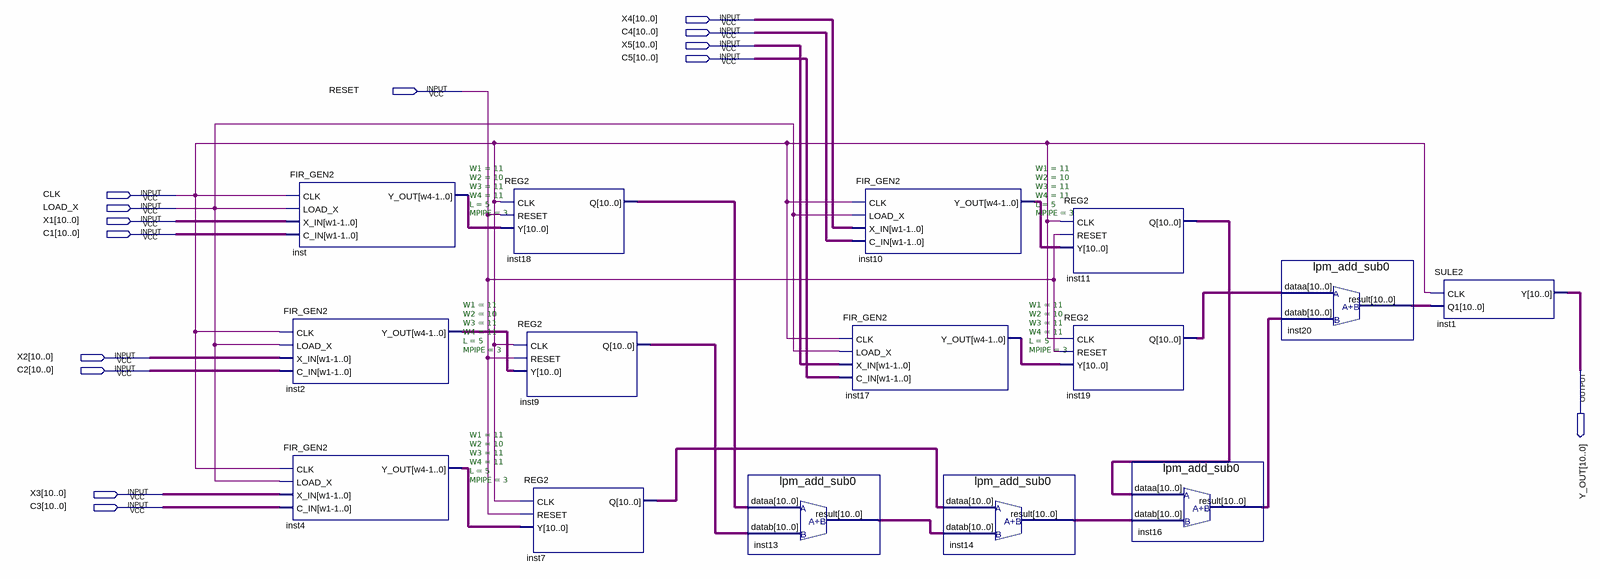
[diagram p0: schematic sheet]
// Quartus schematic CNN3.bdf as structural Verilog: 15 symbols, 14 pins
module CNN3 (
  input  [10:0] X4,
  input  [10:0] C4,
  input  [10:0] X5,
  input  [10:0] C5,
  input  RESET,
  input  CLK,
  input  LOAD_X,
  input  [10:0] X1,
  input  [10:0] C1,
  input  [10:0] X2,
  input  [10:0] C2,
  input  [10:0] X3,
  input  [10:0] C3,
  output [10:0] Y_OUT
);

  wire [10:0] inst2_y_out, inst4_y_out, inst7_q, inst9_q, inst10_y_out, inst11_q, inst13_result,
       inst14_result, inst16_result, inst17_y_out, inst18_q, inst19_q, inst20_result, inst_y_out;

  FIR_GEN2 #(.W1(11), .W2(10), .W3(11), .W4(11), .L(5), .MPIPE(3)) inst (
    .CLK(CLK), .LOAD_X(LOAD_X), .X_IN(X1), .C_IN(C1), .Y_OUT(inst_y_out));
  FIR_GEN2 #(.W1(11), .W2(10), .W3(11), .W4(11), .L(5), .MPIPE(3)) inst2 (
    .CLK(CLK), .LOAD_X(LOAD_X), .X_IN(X2), .C_IN(C2), .Y_OUT(inst2_y_out));
  FIR_GEN2 #(.W1(11), .W2(10), .W3(11), .W4(11), .L(5), .MPIPE(3)) inst4 (
    .CLK(CLK), .LOAD_X(LOAD_X), .X_IN(X3), .C_IN(C3), .Y_OUT(inst4_y_out));
  REG2 inst18 (.CLK(CLK), .RESET(RESET), .Y(inst_y_out), .Q(inst18_q));
  REG2 inst9 (.CLK(CLK), .RESET(RESET), .Y(inst2_y_out), .Q(inst9_q));
  REG2 inst7 (.CLK(CLK), .RESET(RESET), .Y(inst4_y_out), .Q(inst7_q));
  lpm_add_sub0 inst13 (.dataa(inst18_q), .datab(inst9_q), .result(inst13_result));
  FIR_GEN2 #(.W1(11), .W2(10), .W3(11), .W4(11), .L(5), .MPIPE(3)) inst10 (
    .CLK(CLK), .LOAD_X(LOAD_X), .X_IN(X4), .C_IN(C4), .Y_OUT(inst10_y_out));
  FIR_GEN2 #(.W1(11), .W2(10), .W3(11), .W4(11), .L(5), .MPIPE(3)) inst17 (
    .CLK(CLK), .LOAD_X(LOAD_X), .X_IN(X5), .C_IN(C5), .Y_OUT(inst17_y_out));
  lpm_add_sub0 inst14 (.dataa(inst7_q), .datab(inst13_result), .result(inst14_result));
  REG2 inst11 (.CLK(CLK), .RESET(RESET), .Y(inst10_y_out), .Q(inst11_q));
  REG2 inst19 (.CLK(CLK), .RESET(RESET), .Y(inst17_y_out), .Q(inst19_q));
  lpm_add_sub0 inst16 (.dataa(inst11_q), .datab(inst14_result), .result(inst16_result));
  lpm_add_sub0 inst20 (.dataa(inst19_q), .datab(inst16_result), .result(inst20_result));
  SULE2 inst1 (.CLK(CLK), .Q1(inst20_result), .Y(Y_OUT));
endmodule
